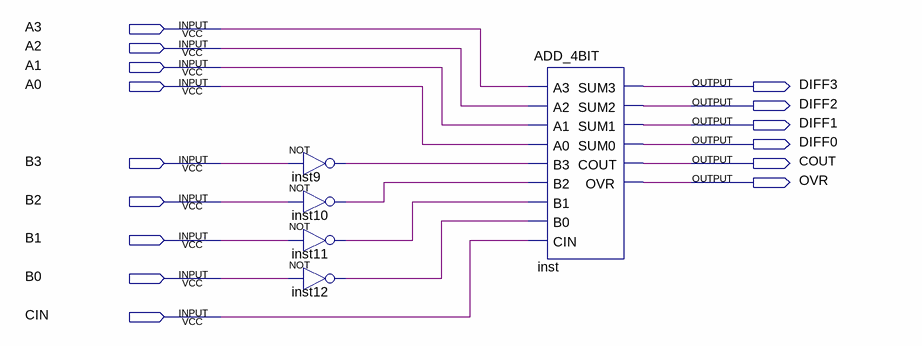
[diagram p0: schematic sheet]
// Quartus schematic SUB_4BIT.bdf as structural Verilog: 5 symbols, 15 pins
module SUB_4BIT (
  input  A3,
  input  A2,
  input  A1,
  input  A0,
  input  B3,
  input  B2,
  input  B1,
  input  B0,
  input  CIN,
  output DIFF3,
  output DIFF2,
  output DIFF1,
  output DIFF0,
  output COUT,
  output OVR
);

  wire inst9_out, inst10_out, inst11_out, inst12_out;

  not inst9 (inst9_out, B3);
  not inst10 (inst10_out, B2);
  not inst11 (inst11_out, B1);
  not inst12 (inst12_out, B0);
  ADD_4BIT inst (
    .A3(A3), .A2(A2), .A1(A1), .A0(A0), .B3(inst9_out), .B2(inst10_out), .B1(inst11_out), .B0(inst12_out),
    .CIN(CIN), .SUM3(DIFF3), .SUM2(DIFF2), .SUM1(DIFF1), .SUM0(DIFF0), .COUT(COUT), .OVR(OVR));
endmodule
